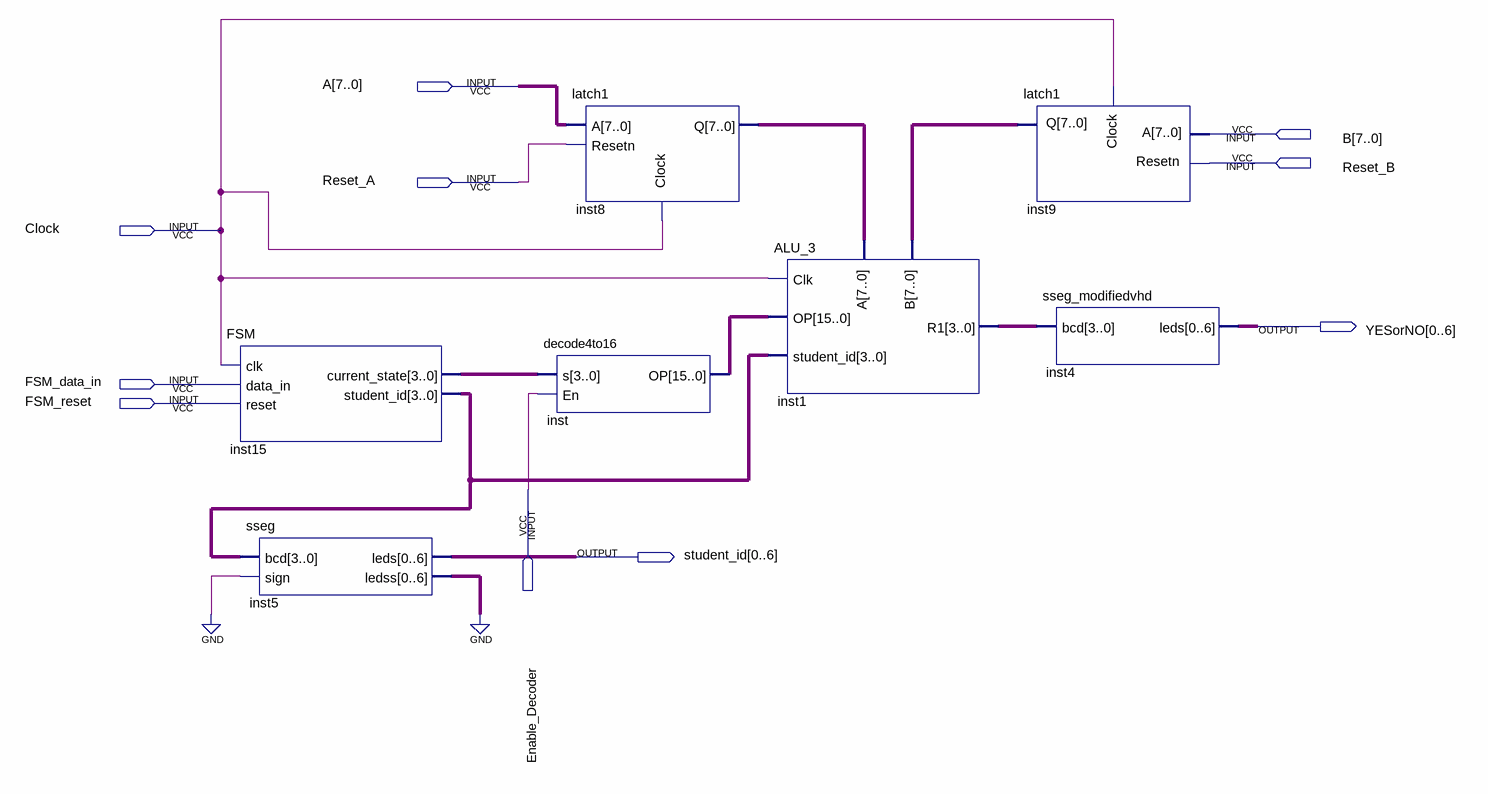
[diagram p0: schematic sheet]
// Quartus schematic Problem3Block.bdf as structural Verilog: 7 symbols, 10 pins
module Problem3Block (
  input  [7:0] A,
  input  [7:0] B,
  input  Reset_B,
  input  Reset_A,
  input  Clock,
  input  FSM_data_in,
  input  FSM_reset,
  input  Enable_Decoder,
  output [0:6] YESorNO,
  output [0:6] student_id
);

  wire [3:0] inst1_r1, inst15_current_state, inst15_student_id;
  wire [6:0] inst5_ledss;
  wire [7:0] inst8_q, inst9_q;
  wire [15:0] inst_op;

  FSM inst15 (
    .clk(Clock), .data_in(FSM_data_in), .reset(FSM_reset), .student_id(inst15_student_id),
    .current_state(inst15_current_state));
  sseg inst5 (.bcd(inst15_student_id), .sign(1'b0), .leds(student_id), .ledss(inst5_ledss));
  decode4to16 inst (.s(inst15_current_state), .En(Enable_Decoder), .OP(inst_op));
  latch1 inst8 (.A(A), .Resetn(Reset_A), .Clock(Clock), .Q(inst8_q));
  ALU_3 inst1 (.Clk(Clock), .A(inst8_q), .B(inst9_q), .student_id(inst15_student_id), .OP(inst_op), .R1(inst1_r1));
  latch1 inst9 (.A(B), .Resetn(Reset_B), .Clock(Clock), .Q(inst9_q));
  sseg_modifiedvhd inst4 (.bcd(inst1_r1), .leds(YESorNO));
  // also tied to GND on the sheet: {inst5_ledss[0], inst5_ledss[1], inst5_ledss[2], inst5_ledss[3], inst5_ledss[4], inst5_ledss[5], inst5_ledss[6]}
endmodule
